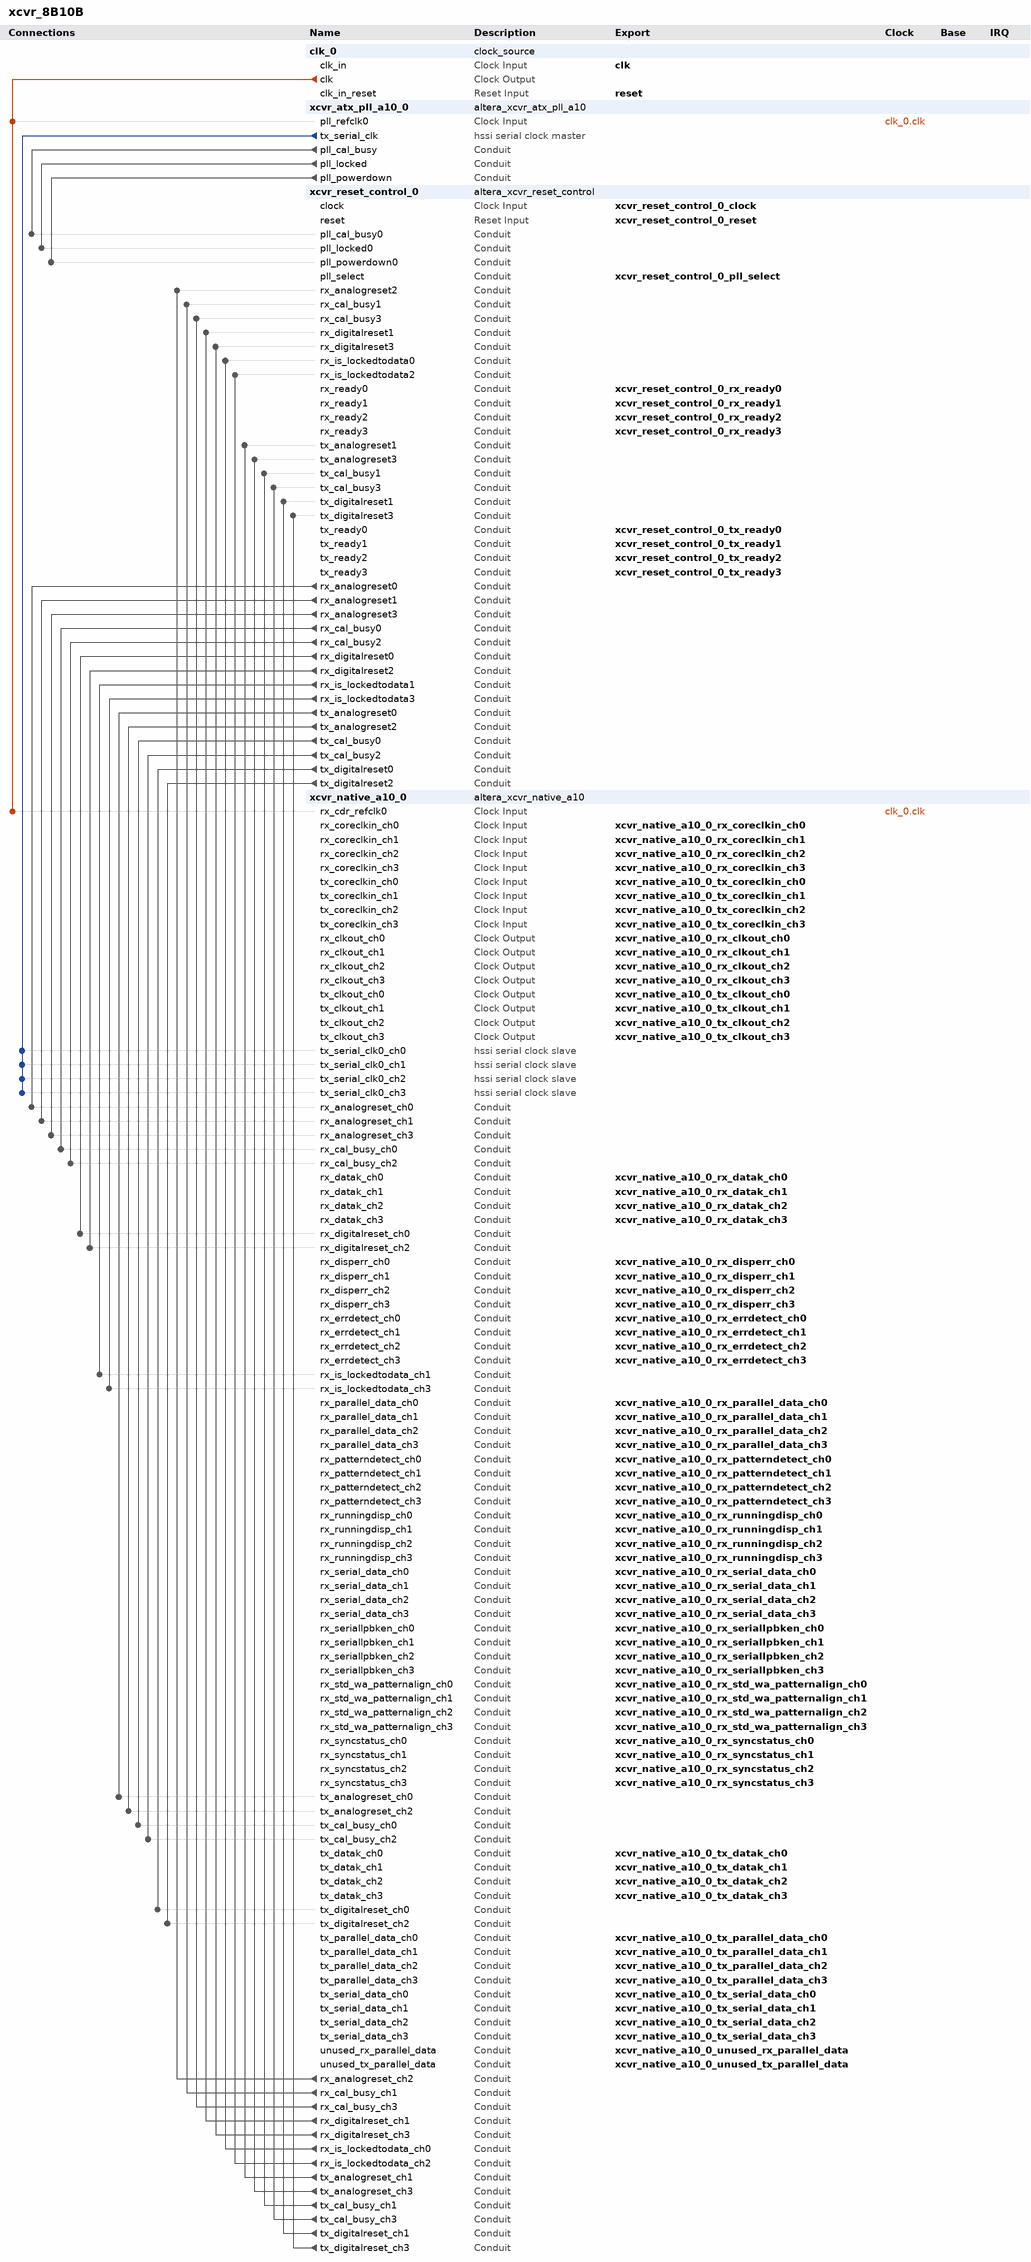
[diagram p0: system contents]
# Platform Designer (Qsys) system xcvr_8B10B, Arria 10 10AX066N3F40E2SG
# Parameters at their usual value, and those the tool derives, are not listed.
package require -exact qsys 18.1
create_system xcvr_8B10B
set_project_property DEVICE_FAMILY {Arria 10}
set_project_property DEVICE 10AX066N3F40E2SG

add_instance clk_0 clock_source 18.1
set_instance_parameter_value clk_0 clockFrequency 127000000

add_instance xcvr_atx_pll_a10_0 altera_xcvr_atx_pll_a10 18.1
set_instance_parameter_value xcvr_atx_pll_a10_0 base_device NIGHTFURY4
set_instance_parameter_value xcvr_atx_pll_a10_0 enable_analog_resets 0
set_instance_parameter_value xcvr_atx_pll_a10_0 enable_bonding_clks 1
set_instance_parameter_value xcvr_atx_pll_a10_0 enable_ext_lockdetect_ports 0
set_instance_parameter_value xcvr_atx_pll_a10_0 enable_manual_configuration 1
set_instance_parameter_value xcvr_atx_pll_a10_0 enable_mcgb 0
set_instance_parameter_value xcvr_atx_pll_a10_0 generate_docs 0
set_instance_parameter_value xcvr_atx_pll_a10_0 pma_width 20
set_instance_parameter_value xcvr_atx_pll_a10_0 rcfg_enable_avmm_busy_port 0
set_instance_parameter_value xcvr_atx_pll_a10_0 rcfg_reduced_files_enable 0
set_instance_parameter_value xcvr_atx_pll_a10_0 rcfg_separate_avmm_busy 0
set_instance_parameter_value xcvr_atx_pll_a10_0 set_auto_reference_clock_frequency 127.0
set_instance_parameter_value xcvr_atx_pll_a10_0 set_fref_clock_frequency 156.25
set_instance_parameter_value xcvr_atx_pll_a10_0 set_k_counter 2000000000
set_instance_parameter_value xcvr_atx_pll_a10_0 set_l_cascade_counter 15
set_instance_parameter_value xcvr_atx_pll_a10_0 set_l_cascade_predivider 1
set_instance_parameter_value xcvr_atx_pll_a10_0 set_l_counter 16
set_instance_parameter_value xcvr_atx_pll_a10_0 set_m_counter 24
set_instance_parameter_value xcvr_atx_pll_a10_0 set_manual_reference_clock_frequency 200.0
set_instance_parameter_value xcvr_atx_pll_a10_0 set_output_clock_frequency 1270.0
set_instance_parameter_value xcvr_atx_pll_a10_0 set_rcfg_emb_strm_enable 0

add_instance xcvr_reset_control_0 altera_xcvr_reset_control 18.1
set_instance_parameter_value xcvr_reset_control_0 CHANNELS 4
set_instance_parameter_value xcvr_reset_control_0 RX_PER_CHANNEL 0
set_instance_parameter_value xcvr_reset_control_0 SYS_CLK_IN_MHZ 127
set_instance_parameter_value xcvr_reset_control_0 TX_PLL_ENABLE 1
set_instance_parameter_value xcvr_reset_control_0 T_RX_ANALOGRESET 70000
set_instance_parameter_value xcvr_reset_control_0 T_TX_ANALOGRESET 70000
set_instance_parameter_value xcvr_reset_control_0 T_TX_DIGITALRESET 70000
set_instance_parameter_value xcvr_reset_control_0 gui_pll_cal_busy 1
set_instance_parameter_value xcvr_reset_control_0 gui_split_interfaces 1

add_instance xcvr_native_a10_0 altera_xcvr_native_a10 18.1
set_instance_parameter_value xcvr_native_a10_0 anlg_voltage 1_0V
set_instance_parameter_value xcvr_native_a10_0 base_device NIGHTFURY4
set_instance_parameter_value xcvr_native_a10_0 bonded_mode not_bonded
set_instance_parameter_value xcvr_native_a10_0 channels 4
set_instance_parameter_value xcvr_native_a10_0 design_environment QSYS
set_instance_parameter_value xcvr_native_a10_0 disable_continuous_dfe false
set_instance_parameter_value xcvr_native_a10_0 enable_pcie_data_mask_option 0
set_instance_parameter_value xcvr_native_a10_0 enable_pcie_dfe_ip false
set_instance_parameter_value xcvr_native_a10_0 enable_port_rx_analog_reset_ack 0
set_instance_parameter_value xcvr_native_a10_0 enable_port_rx_enh_bitslip 0
set_instance_parameter_value xcvr_native_a10_0 enable_port_rx_enh_blk_lock 0
set_instance_parameter_value xcvr_native_a10_0 enable_port_rx_enh_clr_errblk_count 0
set_instance_parameter_value xcvr_native_a10_0 enable_port_rx_enh_data_valid 0
set_instance_parameter_value xcvr_native_a10_0 enable_port_rx_enh_fifo_full 0
set_instance_parameter_value xcvr_native_a10_0 enable_port_rx_enh_fifo_rd_en 0
set_instance_parameter_value xcvr_native_a10_0 enable_port_rx_is_lockedtoref 0
set_instance_parameter_value xcvr_native_a10_0 enable_port_rx_pma_clkout 0
set_instance_parameter_value xcvr_native_a10_0 enable_port_rx_pma_div_clkout 0
set_instance_parameter_value xcvr_native_a10_0 enable_port_rx_polinv 0
set_instance_parameter_value xcvr_native_a10_0 enable_port_rx_seriallpbken_tx 1
set_instance_parameter_value xcvr_native_a10_0 enable_port_rx_std_bitslip 0
set_instance_parameter_value xcvr_native_a10_0 enable_port_rx_std_wa_patternalign 1
set_instance_parameter_value xcvr_native_a10_0 enable_port_tx_analog_reset_ack 0
set_instance_parameter_value xcvr_native_a10_0 enable_port_tx_enh_fifo_full 0
set_instance_parameter_value xcvr_native_a10_0 enable_port_tx_enh_fifo_pfull 0
set_instance_parameter_value xcvr_native_a10_0 enable_port_tx_pma_clkout 0
set_instance_parameter_value xcvr_native_a10_0 enable_port_tx_pma_div_clkout 0
set_instance_parameter_value xcvr_native_a10_0 enable_port_tx_polinv 0
set_instance_parameter_value xcvr_native_a10_0 enable_ports_rx_manual_cdr_mode 0
set_instance_parameter_value xcvr_native_a10_0 enable_simple_interface 1
set_instance_parameter_value xcvr_native_a10_0 enable_skp_ports 0
set_instance_parameter_value xcvr_native_a10_0 enh_pcs_pma_width 40
set_instance_parameter_value xcvr_native_a10_0 enh_pld_pcs_width 40
set_instance_parameter_value xcvr_native_a10_0 enh_rx_blksync_enable 0
set_instance_parameter_value xcvr_native_a10_0 enh_rx_descram_enable 0
set_instance_parameter_value xcvr_native_a10_0 enh_rxfifo_mode {Phase compensation}
set_instance_parameter_value xcvr_native_a10_0 enh_tx_scram_enable 0
set_instance_parameter_value xcvr_native_a10_0 enh_tx_scram_seed 0
set_instance_parameter_value xcvr_native_a10_0 enh_txfifo_mode {Phase compensation}
set_instance_parameter_value xcvr_native_a10_0 generate_add_hdl_instance_example 0
set_instance_parameter_value xcvr_native_a10_0 generate_docs 1
set_instance_parameter_value xcvr_native_a10_0 protocol_mode basic_std
set_instance_parameter_value xcvr_native_a10_0 rcfg_enable 0
set_instance_parameter_value xcvr_native_a10_0 rcfg_file_prefix altera_xcvr_native_a10
set_instance_parameter_value xcvr_native_a10_0 rcfg_h_file_enable 0
set_instance_parameter_value xcvr_native_a10_0 rcfg_iface_enable 0
set_instance_parameter_value xcvr_native_a10_0 rcfg_jtag_enable 0
set_instance_parameter_value xcvr_native_a10_0 rcfg_mif_file_enable 0
set_instance_parameter_value xcvr_native_a10_0 rcfg_multi_enable 0
set_instance_parameter_value xcvr_native_a10_0 rcfg_profile_cnt 2
set_instance_parameter_value xcvr_native_a10_0 rcfg_profile_select 1
set_instance_parameter_value xcvr_native_a10_0 rcfg_reduced_files_enable 0
set_instance_parameter_value xcvr_native_a10_0 rcfg_separate_avmm_busy 0
set_instance_parameter_value xcvr_native_a10_0 rcfg_shared 0
set_instance_parameter_value xcvr_native_a10_0 rcfg_sv_file_enable 0
set_instance_parameter_value xcvr_native_a10_0 rx_pma_div_clkout_divider 0
set_instance_parameter_value xcvr_native_a10_0 set_capability_reg_enable 0
set_instance_parameter_value xcvr_native_a10_0 set_cdr_refclk_freq 127.000000
set_instance_parameter_value xcvr_native_a10_0 set_csr_soft_logic_enable 0
set_instance_parameter_value xcvr_native_a10_0 set_data_rate 2540
set_instance_parameter_value xcvr_native_a10_0 set_disconnect_analog_resets 0
set_instance_parameter_value xcvr_native_a10_0 set_odi_soft_logic_enable 0
set_instance_parameter_value xcvr_native_a10_0 set_prbs_soft_logic_enable 0
set_instance_parameter_value xcvr_native_a10_0 sim_reduced_counters false
set_instance_parameter_value xcvr_native_a10_0 std_data_mask_count_multi 0
set_instance_parameter_value xcvr_native_a10_0 std_pcs_pma_width 20
set_instance_parameter_value xcvr_native_a10_0 std_rx_8b10b_enable 1
set_instance_parameter_value xcvr_native_a10_0 std_rx_byte_deser_mode Disabled
set_instance_parameter_value xcvr_native_a10_0 std_rx_polinv_enable 0
set_instance_parameter_value xcvr_native_a10_0 std_rx_word_aligner_mode {manual (PLD controlled)}
set_instance_parameter_value xcvr_native_a10_0 std_rx_word_aligner_pattern 380
set_instance_parameter_value xcvr_native_a10_0 std_rx_word_aligner_pattern_len 10
set_instance_parameter_value xcvr_native_a10_0 std_tx_8b10b_enable 1
set_instance_parameter_value xcvr_native_a10_0 std_tx_byte_ser_mode Disabled
set_instance_parameter_value xcvr_native_a10_0 std_tx_polinv_enable 0
set_instance_parameter_value xcvr_native_a10_0 tx_pma_div_clkout_divider 0

# connections
add_connection clk_0.clk xcvr_atx_pll_a10_0.pll_refclk0 clock
add_connection clk_0.clk xcvr_native_a10_0.rx_cdr_refclk0 clock
add_connection xcvr_atx_pll_a10_0.pll_cal_busy xcvr_reset_control_0.pll_cal_busy0 conduit
add_connection xcvr_atx_pll_a10_0.pll_locked xcvr_reset_control_0.pll_locked0 conduit
add_connection xcvr_atx_pll_a10_0.pll_powerdown xcvr_reset_control_0.pll_powerdown0 conduit
add_connection xcvr_native_a10_0.rx_analogreset_ch2 xcvr_reset_control_0.rx_analogreset2 conduit
add_connection xcvr_native_a10_0.rx_cal_busy_ch1 xcvr_reset_control_0.rx_cal_busy1 conduit
add_connection xcvr_native_a10_0.rx_cal_busy_ch3 xcvr_reset_control_0.rx_cal_busy3 conduit
add_connection xcvr_native_a10_0.rx_digitalreset_ch1 xcvr_reset_control_0.rx_digitalreset1 conduit
add_connection xcvr_native_a10_0.rx_digitalreset_ch3 xcvr_reset_control_0.rx_digitalreset3 conduit
add_connection xcvr_native_a10_0.rx_is_lockedtodata_ch0 xcvr_reset_control_0.rx_is_lockedtodata0 conduit
add_connection xcvr_native_a10_0.rx_is_lockedtodata_ch2 xcvr_reset_control_0.rx_is_lockedtodata2 conduit
add_connection xcvr_native_a10_0.tx_analogreset_ch1 xcvr_reset_control_0.tx_analogreset1 conduit
add_connection xcvr_native_a10_0.tx_analogreset_ch3 xcvr_reset_control_0.tx_analogreset3 conduit
add_connection xcvr_native_a10_0.tx_cal_busy_ch1 xcvr_reset_control_0.tx_cal_busy1 conduit
add_connection xcvr_native_a10_0.tx_cal_busy_ch3 xcvr_reset_control_0.tx_cal_busy3 conduit
add_connection xcvr_native_a10_0.tx_digitalreset_ch1 xcvr_reset_control_0.tx_digitalreset1 conduit
add_connection xcvr_native_a10_0.tx_digitalreset_ch3 xcvr_reset_control_0.tx_digitalreset3 conduit
add_connection xcvr_reset_control_0.rx_analogreset0 xcvr_native_a10_0.rx_analogreset_ch0 conduit
add_connection xcvr_reset_control_0.rx_analogreset1 xcvr_native_a10_0.rx_analogreset_ch1 conduit
add_connection xcvr_reset_control_0.rx_analogreset3 xcvr_native_a10_0.rx_analogreset_ch3 conduit
add_connection xcvr_reset_control_0.rx_cal_busy0 xcvr_native_a10_0.rx_cal_busy_ch0 conduit
add_connection xcvr_reset_control_0.rx_cal_busy2 xcvr_native_a10_0.rx_cal_busy_ch2 conduit
add_connection xcvr_reset_control_0.rx_digitalreset0 xcvr_native_a10_0.rx_digitalreset_ch0 conduit
add_connection xcvr_reset_control_0.rx_digitalreset2 xcvr_native_a10_0.rx_digitalreset_ch2 conduit
add_connection xcvr_reset_control_0.rx_is_lockedtodata1 xcvr_native_a10_0.rx_is_lockedtodata_ch1 conduit
add_connection xcvr_reset_control_0.rx_is_lockedtodata3 xcvr_native_a10_0.rx_is_lockedtodata_ch3 conduit
add_connection xcvr_reset_control_0.tx_analogreset0 xcvr_native_a10_0.tx_analogreset_ch0 conduit
add_connection xcvr_reset_control_0.tx_analogreset2 xcvr_native_a10_0.tx_analogreset_ch2 conduit
add_connection xcvr_reset_control_0.tx_cal_busy0 xcvr_native_a10_0.tx_cal_busy_ch0 conduit
add_connection xcvr_reset_control_0.tx_cal_busy2 xcvr_native_a10_0.tx_cal_busy_ch2 conduit
add_connection xcvr_reset_control_0.tx_digitalreset0 xcvr_native_a10_0.tx_digitalreset_ch0 conduit
add_connection xcvr_reset_control_0.tx_digitalreset2 xcvr_native_a10_0.tx_digitalreset_ch2 conduit
add_connection xcvr_atx_pll_a10_0.tx_serial_clk xcvr_native_a10_0.tx_serial_clk0_ch0 hssi_serial_clock
add_connection xcvr_atx_pll_a10_0.tx_serial_clk xcvr_native_a10_0.tx_serial_clk0_ch1 hssi_serial_clock
add_connection xcvr_atx_pll_a10_0.tx_serial_clk xcvr_native_a10_0.tx_serial_clk0_ch2 hssi_serial_clock
add_connection xcvr_atx_pll_a10_0.tx_serial_clk xcvr_native_a10_0.tx_serial_clk0_ch3 hssi_serial_clock

# exported interfaces
add_interface clk clock sink
set_interface_property clk EXPORT_OF clk_0.clk_in
add_interface reset reset sink
set_interface_property reset EXPORT_OF clk_0.clk_in_reset
add_interface xcvr_native_a10_0_rx_clkout_ch0 clock source
set_interface_property xcvr_native_a10_0_rx_clkout_ch0 EXPORT_OF xcvr_native_a10_0.rx_clkout_ch0
add_interface xcvr_native_a10_0_rx_clkout_ch1 clock source
set_interface_property xcvr_native_a10_0_rx_clkout_ch1 EXPORT_OF xcvr_native_a10_0.rx_clkout_ch1
add_interface xcvr_native_a10_0_rx_clkout_ch2 clock source
set_interface_property xcvr_native_a10_0_rx_clkout_ch2 EXPORT_OF xcvr_native_a10_0.rx_clkout_ch2
add_interface xcvr_native_a10_0_rx_clkout_ch3 clock source
set_interface_property xcvr_native_a10_0_rx_clkout_ch3 EXPORT_OF xcvr_native_a10_0.rx_clkout_ch3
add_interface xcvr_native_a10_0_rx_coreclkin_ch0 clock sink
set_interface_property xcvr_native_a10_0_rx_coreclkin_ch0 EXPORT_OF xcvr_native_a10_0.rx_coreclkin_ch0
add_interface xcvr_native_a10_0_rx_coreclkin_ch1 clock sink
set_interface_property xcvr_native_a10_0_rx_coreclkin_ch1 EXPORT_OF xcvr_native_a10_0.rx_coreclkin_ch1
add_interface xcvr_native_a10_0_rx_coreclkin_ch2 clock sink
set_interface_property xcvr_native_a10_0_rx_coreclkin_ch2 EXPORT_OF xcvr_native_a10_0.rx_coreclkin_ch2
add_interface xcvr_native_a10_0_rx_coreclkin_ch3 clock sink
set_interface_property xcvr_native_a10_0_rx_coreclkin_ch3 EXPORT_OF xcvr_native_a10_0.rx_coreclkin_ch3
add_interface xcvr_native_a10_0_rx_datak_ch0 conduit end
set_interface_property xcvr_native_a10_0_rx_datak_ch0 EXPORT_OF xcvr_native_a10_0.rx_datak_ch0
add_interface xcvr_native_a10_0_rx_datak_ch1 conduit end
set_interface_property xcvr_native_a10_0_rx_datak_ch1 EXPORT_OF xcvr_native_a10_0.rx_datak_ch1
add_interface xcvr_native_a10_0_rx_datak_ch2 conduit end
set_interface_property xcvr_native_a10_0_rx_datak_ch2 EXPORT_OF xcvr_native_a10_0.rx_datak_ch2
add_interface xcvr_native_a10_0_rx_datak_ch3 conduit end
set_interface_property xcvr_native_a10_0_rx_datak_ch3 EXPORT_OF xcvr_native_a10_0.rx_datak_ch3
add_interface xcvr_native_a10_0_rx_disperr_ch0 conduit end
set_interface_property xcvr_native_a10_0_rx_disperr_ch0 EXPORT_OF xcvr_native_a10_0.rx_disperr_ch0
add_interface xcvr_native_a10_0_rx_disperr_ch1 conduit end
set_interface_property xcvr_native_a10_0_rx_disperr_ch1 EXPORT_OF xcvr_native_a10_0.rx_disperr_ch1
add_interface xcvr_native_a10_0_rx_disperr_ch2 conduit end
set_interface_property xcvr_native_a10_0_rx_disperr_ch2 EXPORT_OF xcvr_native_a10_0.rx_disperr_ch2
add_interface xcvr_native_a10_0_rx_disperr_ch3 conduit end
set_interface_property xcvr_native_a10_0_rx_disperr_ch3 EXPORT_OF xcvr_native_a10_0.rx_disperr_ch3
add_interface xcvr_native_a10_0_rx_errdetect_ch0 conduit end
set_interface_property xcvr_native_a10_0_rx_errdetect_ch0 EXPORT_OF xcvr_native_a10_0.rx_errdetect_ch0
add_interface xcvr_native_a10_0_rx_errdetect_ch1 conduit end
set_interface_property xcvr_native_a10_0_rx_errdetect_ch1 EXPORT_OF xcvr_native_a10_0.rx_errdetect_ch1
add_interface xcvr_native_a10_0_rx_errdetect_ch2 conduit end
set_interface_property xcvr_native_a10_0_rx_errdetect_ch2 EXPORT_OF xcvr_native_a10_0.rx_errdetect_ch2
add_interface xcvr_native_a10_0_rx_errdetect_ch3 conduit end
set_interface_property xcvr_native_a10_0_rx_errdetect_ch3 EXPORT_OF xcvr_native_a10_0.rx_errdetect_ch3
add_interface xcvr_native_a10_0_rx_parallel_data_ch0 conduit end
set_interface_property xcvr_native_a10_0_rx_parallel_data_ch0 EXPORT_OF xcvr_native_a10_0.rx_parallel_data_ch0
add_interface xcvr_native_a10_0_rx_parallel_data_ch1 conduit end
set_interface_property xcvr_native_a10_0_rx_parallel_data_ch1 EXPORT_OF xcvr_native_a10_0.rx_parallel_data_ch1
add_interface xcvr_native_a10_0_rx_parallel_data_ch2 conduit end
set_interface_property xcvr_native_a10_0_rx_parallel_data_ch2 EXPORT_OF xcvr_native_a10_0.rx_parallel_data_ch2
add_interface xcvr_native_a10_0_rx_parallel_data_ch3 conduit end
set_interface_property xcvr_native_a10_0_rx_parallel_data_ch3 EXPORT_OF xcvr_native_a10_0.rx_parallel_data_ch3
add_interface xcvr_native_a10_0_rx_patterndetect_ch0 conduit end
set_interface_property xcvr_native_a10_0_rx_patterndetect_ch0 EXPORT_OF xcvr_native_a10_0.rx_patterndetect_ch0
add_interface xcvr_native_a10_0_rx_patterndetect_ch1 conduit end
set_interface_property xcvr_native_a10_0_rx_patterndetect_ch1 EXPORT_OF xcvr_native_a10_0.rx_patterndetect_ch1
add_interface xcvr_native_a10_0_rx_patterndetect_ch2 conduit end
set_interface_property xcvr_native_a10_0_rx_patterndetect_ch2 EXPORT_OF xcvr_native_a10_0.rx_patterndetect_ch2
add_interface xcvr_native_a10_0_rx_patterndetect_ch3 conduit end
set_interface_property xcvr_native_a10_0_rx_patterndetect_ch3 EXPORT_OF xcvr_native_a10_0.rx_patterndetect_ch3
add_interface xcvr_native_a10_0_rx_runningdisp_ch0 conduit end
set_interface_property xcvr_native_a10_0_rx_runningdisp_ch0 EXPORT_OF xcvr_native_a10_0.rx_runningdisp_ch0
add_interface xcvr_native_a10_0_rx_runningdisp_ch1 conduit end
set_interface_property xcvr_native_a10_0_rx_runningdisp_ch1 EXPORT_OF xcvr_native_a10_0.rx_runningdisp_ch1
add_interface xcvr_native_a10_0_rx_runningdisp_ch2 conduit end
set_interface_property xcvr_native_a10_0_rx_runningdisp_ch2 EXPORT_OF xcvr_native_a10_0.rx_runningdisp_ch2
add_interface xcvr_native_a10_0_rx_runningdisp_ch3 conduit end
set_interface_property xcvr_native_a10_0_rx_runningdisp_ch3 EXPORT_OF xcvr_native_a10_0.rx_runningdisp_ch3
add_interface xcvr_native_a10_0_rx_serial_data_ch0 conduit end
set_interface_property xcvr_native_a10_0_rx_serial_data_ch0 EXPORT_OF xcvr_native_a10_0.rx_serial_data_ch0
add_interface xcvr_native_a10_0_rx_serial_data_ch1 conduit end
set_interface_property xcvr_native_a10_0_rx_serial_data_ch1 EXPORT_OF xcvr_native_a10_0.rx_serial_data_ch1
add_interface xcvr_native_a10_0_rx_serial_data_ch2 conduit end
set_interface_property xcvr_native_a10_0_rx_serial_data_ch2 EXPORT_OF xcvr_native_a10_0.rx_serial_data_ch2
add_interface xcvr_native_a10_0_rx_serial_data_ch3 conduit end
set_interface_property xcvr_native_a10_0_rx_serial_data_ch3 EXPORT_OF xcvr_native_a10_0.rx_serial_data_ch3
add_interface xcvr_native_a10_0_rx_seriallpbken_ch0 conduit end
set_interface_property xcvr_native_a10_0_rx_seriallpbken_ch0 EXPORT_OF xcvr_native_a10_0.rx_seriallpbken_ch0
add_interface xcvr_native_a10_0_rx_seriallpbken_ch1 conduit end
set_interface_property xcvr_native_a10_0_rx_seriallpbken_ch1 EXPORT_OF xcvr_native_a10_0.rx_seriallpbken_ch1
add_interface xcvr_native_a10_0_rx_seriallpbken_ch2 conduit end
set_interface_property xcvr_native_a10_0_rx_seriallpbken_ch2 EXPORT_OF xcvr_native_a10_0.rx_seriallpbken_ch2
add_interface xcvr_native_a10_0_rx_seriallpbken_ch3 conduit end
set_interface_property xcvr_native_a10_0_rx_seriallpbken_ch3 EXPORT_OF xcvr_native_a10_0.rx_seriallpbken_ch3
add_interface xcvr_native_a10_0_rx_std_wa_patternalign_ch0 conduit end
set_interface_property xcvr_native_a10_0_rx_std_wa_patternalign_ch0 EXPORT_OF xcvr_native_a10_0.rx_std_wa_patternalign_ch0
add_interface xcvr_native_a10_0_rx_std_wa_patternalign_ch1 conduit end
set_interface_property xcvr_native_a10_0_rx_std_wa_patternalign_ch1 EXPORT_OF xcvr_native_a10_0.rx_std_wa_patternalign_ch1
add_interface xcvr_native_a10_0_rx_std_wa_patternalign_ch2 conduit end
set_interface_property xcvr_native_a10_0_rx_std_wa_patternalign_ch2 EXPORT_OF xcvr_native_a10_0.rx_std_wa_patternalign_ch2
add_interface xcvr_native_a10_0_rx_std_wa_patternalign_ch3 conduit end
set_interface_property xcvr_native_a10_0_rx_std_wa_patternalign_ch3 EXPORT_OF xcvr_native_a10_0.rx_std_wa_patternalign_ch3
add_interface xcvr_native_a10_0_rx_syncstatus_ch0 conduit end
set_interface_property xcvr_native_a10_0_rx_syncstatus_ch0 EXPORT_OF xcvr_native_a10_0.rx_syncstatus_ch0
add_interface xcvr_native_a10_0_rx_syncstatus_ch1 conduit end
set_interface_property xcvr_native_a10_0_rx_syncstatus_ch1 EXPORT_OF xcvr_native_a10_0.rx_syncstatus_ch1
add_interface xcvr_native_a10_0_rx_syncstatus_ch2 conduit end
set_interface_property xcvr_native_a10_0_rx_syncstatus_ch2 EXPORT_OF xcvr_native_a10_0.rx_syncstatus_ch2
add_interface xcvr_native_a10_0_rx_syncstatus_ch3 conduit end
set_interface_property xcvr_native_a10_0_rx_syncstatus_ch3 EXPORT_OF xcvr_native_a10_0.rx_syncstatus_ch3
add_interface xcvr_native_a10_0_tx_clkout_ch0 clock source
set_interface_property xcvr_native_a10_0_tx_clkout_ch0 EXPORT_OF xcvr_native_a10_0.tx_clkout_ch0
add_interface xcvr_native_a10_0_tx_clkout_ch1 clock source
set_interface_property xcvr_native_a10_0_tx_clkout_ch1 EXPORT_OF xcvr_native_a10_0.tx_clkout_ch1
add_interface xcvr_native_a10_0_tx_clkout_ch2 clock source
set_interface_property xcvr_native_a10_0_tx_clkout_ch2 EXPORT_OF xcvr_native_a10_0.tx_clkout_ch2
add_interface xcvr_native_a10_0_tx_clkout_ch3 clock source
set_interface_property xcvr_native_a10_0_tx_clkout_ch3 EXPORT_OF xcvr_native_a10_0.tx_clkout_ch3
add_interface xcvr_native_a10_0_tx_coreclkin_ch0 clock sink
set_interface_property xcvr_native_a10_0_tx_coreclkin_ch0 EXPORT_OF xcvr_native_a10_0.tx_coreclkin_ch0
add_interface xcvr_native_a10_0_tx_coreclkin_ch1 clock sink
set_interface_property xcvr_native_a10_0_tx_coreclkin_ch1 EXPORT_OF xcvr_native_a10_0.tx_coreclkin_ch1
add_interface xcvr_native_a10_0_tx_coreclkin_ch2 clock sink
set_interface_property xcvr_native_a10_0_tx_coreclkin_ch2 EXPORT_OF xcvr_native_a10_0.tx_coreclkin_ch2
add_interface xcvr_native_a10_0_tx_coreclkin_ch3 clock sink
set_interface_property xcvr_native_a10_0_tx_coreclkin_ch3 EXPORT_OF xcvr_native_a10_0.tx_coreclkin_ch3
add_interface xcvr_native_a10_0_tx_datak_ch0 conduit end
set_interface_property xcvr_native_a10_0_tx_datak_ch0 EXPORT_OF xcvr_native_a10_0.tx_datak_ch0
add_interface xcvr_native_a10_0_tx_datak_ch1 conduit end
set_interface_property xcvr_native_a10_0_tx_datak_ch1 EXPORT_OF xcvr_native_a10_0.tx_datak_ch1
add_interface xcvr_native_a10_0_tx_datak_ch2 conduit end
set_interface_property xcvr_native_a10_0_tx_datak_ch2 EXPORT_OF xcvr_native_a10_0.tx_datak_ch2
add_interface xcvr_native_a10_0_tx_datak_ch3 conduit end
set_interface_property xcvr_native_a10_0_tx_datak_ch3 EXPORT_OF xcvr_native_a10_0.tx_datak_ch3
add_interface xcvr_native_a10_0_tx_parallel_data_ch0 conduit end
set_interface_property xcvr_native_a10_0_tx_parallel_data_ch0 EXPORT_OF xcvr_native_a10_0.tx_parallel_data_ch0
add_interface xcvr_native_a10_0_tx_parallel_data_ch1 conduit end
set_interface_property xcvr_native_a10_0_tx_parallel_data_ch1 EXPORT_OF xcvr_native_a10_0.tx_parallel_data_ch1
add_interface xcvr_native_a10_0_tx_parallel_data_ch2 conduit end
set_interface_property xcvr_native_a10_0_tx_parallel_data_ch2 EXPORT_OF xcvr_native_a10_0.tx_parallel_data_ch2
add_interface xcvr_native_a10_0_tx_parallel_data_ch3 conduit end
set_interface_property xcvr_native_a10_0_tx_parallel_data_ch3 EXPORT_OF xcvr_native_a10_0.tx_parallel_data_ch3
add_interface xcvr_native_a10_0_tx_serial_data_ch0 conduit end
set_interface_property xcvr_native_a10_0_tx_serial_data_ch0 EXPORT_OF xcvr_native_a10_0.tx_serial_data_ch0
add_interface xcvr_native_a10_0_tx_serial_data_ch1 conduit end
set_interface_property xcvr_native_a10_0_tx_serial_data_ch1 EXPORT_OF xcvr_native_a10_0.tx_serial_data_ch1
add_interface xcvr_native_a10_0_tx_serial_data_ch2 conduit end
set_interface_property xcvr_native_a10_0_tx_serial_data_ch2 EXPORT_OF xcvr_native_a10_0.tx_serial_data_ch2
add_interface xcvr_native_a10_0_tx_serial_data_ch3 conduit end
set_interface_property xcvr_native_a10_0_tx_serial_data_ch3 EXPORT_OF xcvr_native_a10_0.tx_serial_data_ch3
add_interface xcvr_native_a10_0_unused_rx_parallel_data conduit end
set_interface_property xcvr_native_a10_0_unused_rx_parallel_data EXPORT_OF xcvr_native_a10_0.unused_rx_parallel_data
add_interface xcvr_native_a10_0_unused_tx_parallel_data conduit end
set_interface_property xcvr_native_a10_0_unused_tx_parallel_data EXPORT_OF xcvr_native_a10_0.unused_tx_parallel_data
add_interface xcvr_reset_control_0_clock clock sink
set_interface_property xcvr_reset_control_0_clock EXPORT_OF xcvr_reset_control_0.clock
add_interface xcvr_reset_control_0_pll_select conduit end
set_interface_property xcvr_reset_control_0_pll_select EXPORT_OF xcvr_reset_control_0.pll_select
add_interface xcvr_reset_control_0_reset reset sink
set_interface_property xcvr_reset_control_0_reset EXPORT_OF xcvr_reset_control_0.reset
add_interface xcvr_reset_control_0_rx_ready0 conduit end
set_interface_property xcvr_reset_control_0_rx_ready0 EXPORT_OF xcvr_reset_control_0.rx_ready0
add_interface xcvr_reset_control_0_rx_ready1 conduit end
set_interface_property xcvr_reset_control_0_rx_ready1 EXPORT_OF xcvr_reset_control_0.rx_ready1
add_interface xcvr_reset_control_0_rx_ready2 conduit end
set_interface_property xcvr_reset_control_0_rx_ready2 EXPORT_OF xcvr_reset_control_0.rx_ready2
add_interface xcvr_reset_control_0_rx_ready3 conduit end
set_interface_property xcvr_reset_control_0_rx_ready3 EXPORT_OF xcvr_reset_control_0.rx_ready3
add_interface xcvr_reset_control_0_tx_ready0 conduit end
set_interface_property xcvr_reset_control_0_tx_ready0 EXPORT_OF xcvr_reset_control_0.tx_ready0
add_interface xcvr_reset_control_0_tx_ready1 conduit end
set_interface_property xcvr_reset_control_0_tx_ready1 EXPORT_OF xcvr_reset_control_0.tx_ready1
add_interface xcvr_reset_control_0_tx_ready2 conduit end
set_interface_property xcvr_reset_control_0_tx_ready2 EXPORT_OF xcvr_reset_control_0.tx_ready2
add_interface xcvr_reset_control_0_tx_ready3 conduit end
set_interface_property xcvr_reset_control_0_tx_ready3 EXPORT_OF xcvr_reset_control_0.tx_ready3

set_interconnect_requirement {$system} qsys_mm.clockCrossingAdapter HANDSHAKE
set_interconnect_requirement {$system} qsys_mm.enableEccProtection FALSE
set_interconnect_requirement {$system} qsys_mm.insertDefaultSlave FALSE
set_interconnect_requirement {$system} qsys_mm.maxAdditionalLatency 1

save_system xcvr_8B10B.qsys
